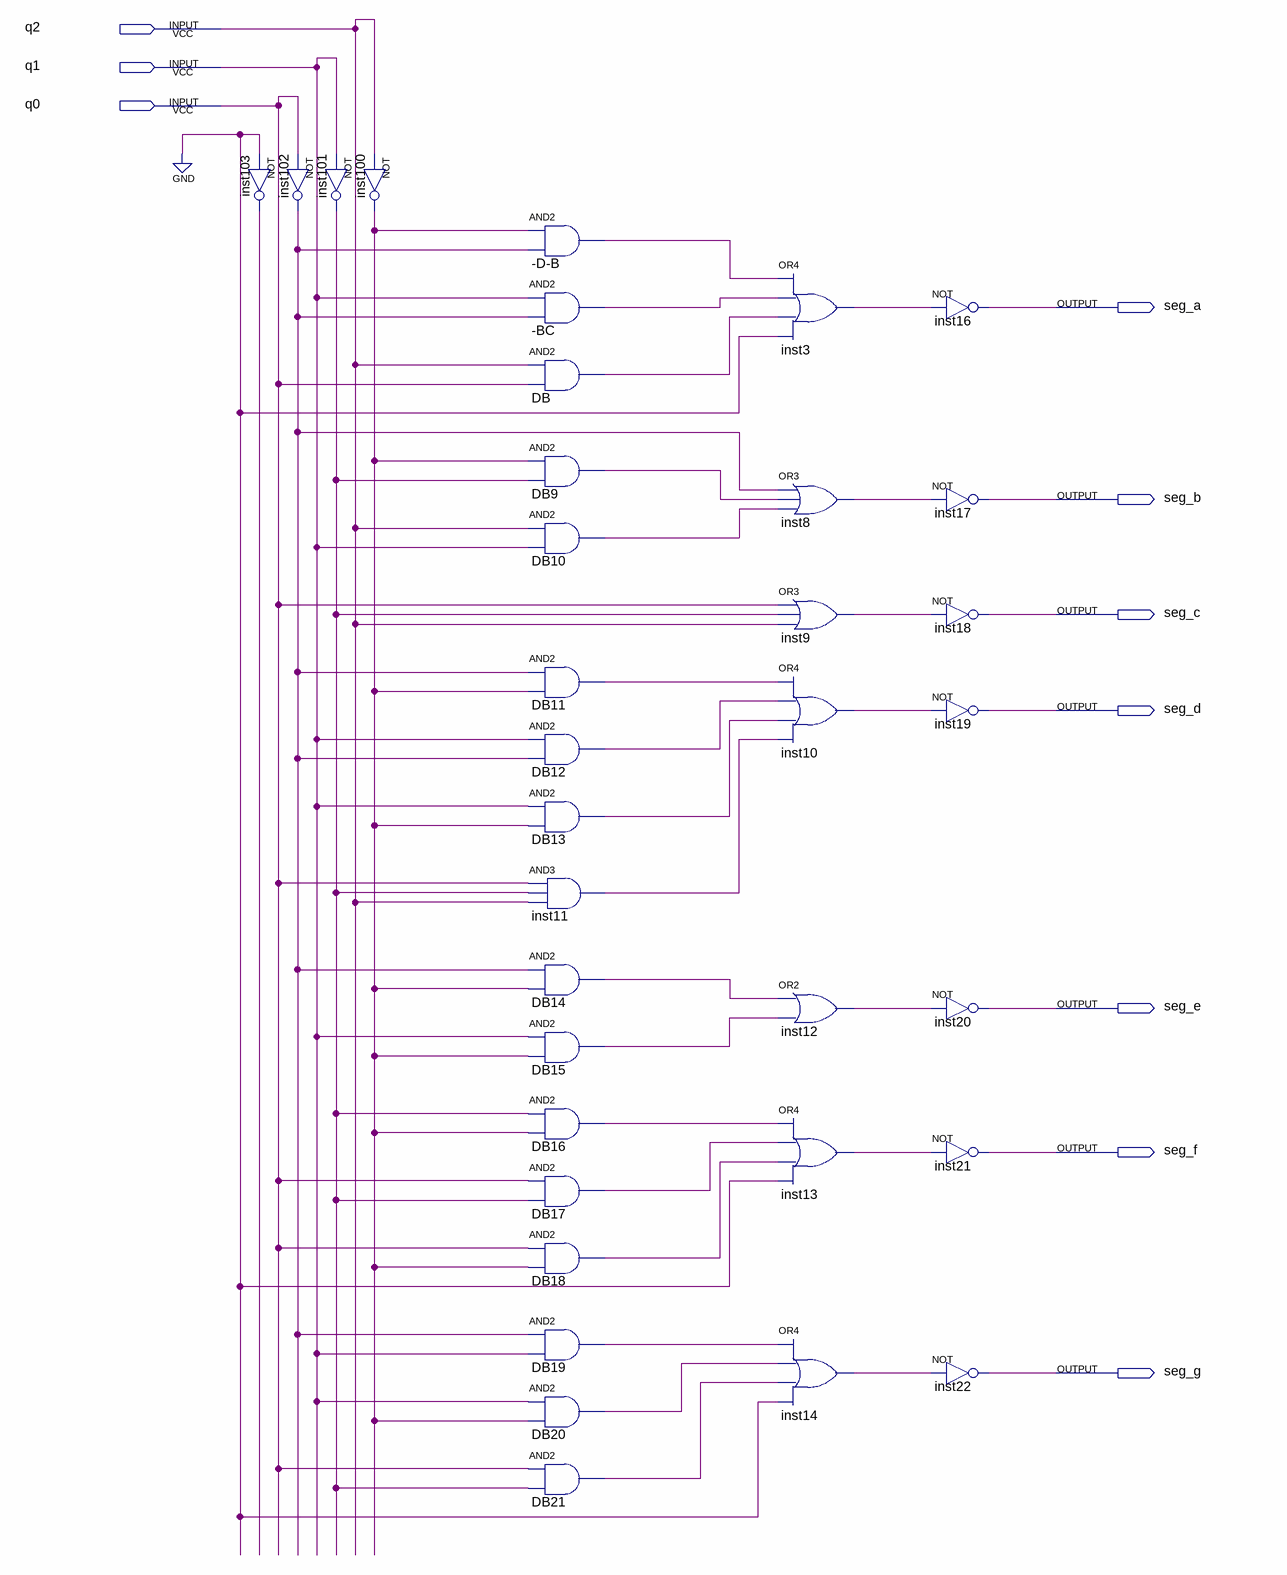
[diagram p0: schematic sheet]
// Quartus schematic 7seg.bdf as structural Verilog: 35 symbols, 10 pins
module \7seg  (
  input  q2,
  input  q1,
  input  q0,
  output seg_a,
  output seg_b,
  output seg_c,
  output seg_d,
  output seg_e,
  output seg_f,
  output seg_g
);

  wire _BC_out, _D_B_out, DB9_out, DB10_out, DB11_out, DB12_out, DB13_out, DB14_out, DB15_out, DB16_out,
       DB17_out, DB18_out, DB19_out, DB20_out, DB21_out, DB_out, inst3_out, inst8_out, inst9_out, inst10_out,
       inst11_out, inst12_out, inst13_out, inst14_out, inst100_out, inst101_out, inst102_out, inst103_out;

  not inst103 (inst103_out, 1'b0);
  not inst101 (inst101_out, q1);
  not inst102 (inst102_out, q0);
  not inst100 (inst100_out, q2);
  and \u_-D-B  (_D_B_out, inst100_out, inst102_out);
  and \u_-BC  (_BC_out, q1, inst102_out);
  and DB (DB_out, q2, q0);
  and DB9 (DB9_out, inst100_out, inst101_out);
  and DB10 (DB10_out, q2, q1);
  and DB11 (DB11_out, inst102_out, inst100_out);
  and DB12 (DB12_out, q1, inst102_out);
  and DB13 (DB13_out, q1, inst100_out);
  and inst11 (inst11_out, q0, inst101_out, q2);
  and DB14 (DB14_out, inst102_out, inst100_out);
  and DB15 (DB15_out, q1, inst100_out);
  and DB16 (DB16_out, inst101_out, inst100_out);
  and DB17 (DB17_out, q0, inst101_out);
  and DB18 (DB18_out, q0, inst100_out);
  and DB19 (DB19_out, inst102_out, q1);
  and DB20 (DB20_out, q1, inst100_out);
  and DB21 (DB21_out, q0, inst101_out);
  or inst3 (inst3_out, _D_B_out, _BC_out, DB_out, 1'b0);
  or inst8 (inst8_out, inst102_out, DB9_out, DB10_out);
  or inst9 (inst9_out, q0, inst101_out, q2);
  or inst10 (inst10_out, DB11_out, DB12_out, DB13_out, inst11_out);
  or inst12 (inst12_out, DB14_out, DB15_out);
  or inst13 (inst13_out, DB16_out, DB17_out, DB18_out, 1'b0);
  or inst14 (inst14_out, DB19_out, DB20_out, DB21_out, 1'b0);
  not inst16 (seg_a, inst3_out);
  not inst17 (seg_b, inst8_out);
  not inst18 (seg_c, inst9_out);
  not inst19 (seg_d, inst10_out);
  not inst20 (seg_e, inst12_out);
  not inst21 (seg_f, inst13_out);
  not inst22 (seg_g, inst14_out);
endmodule
